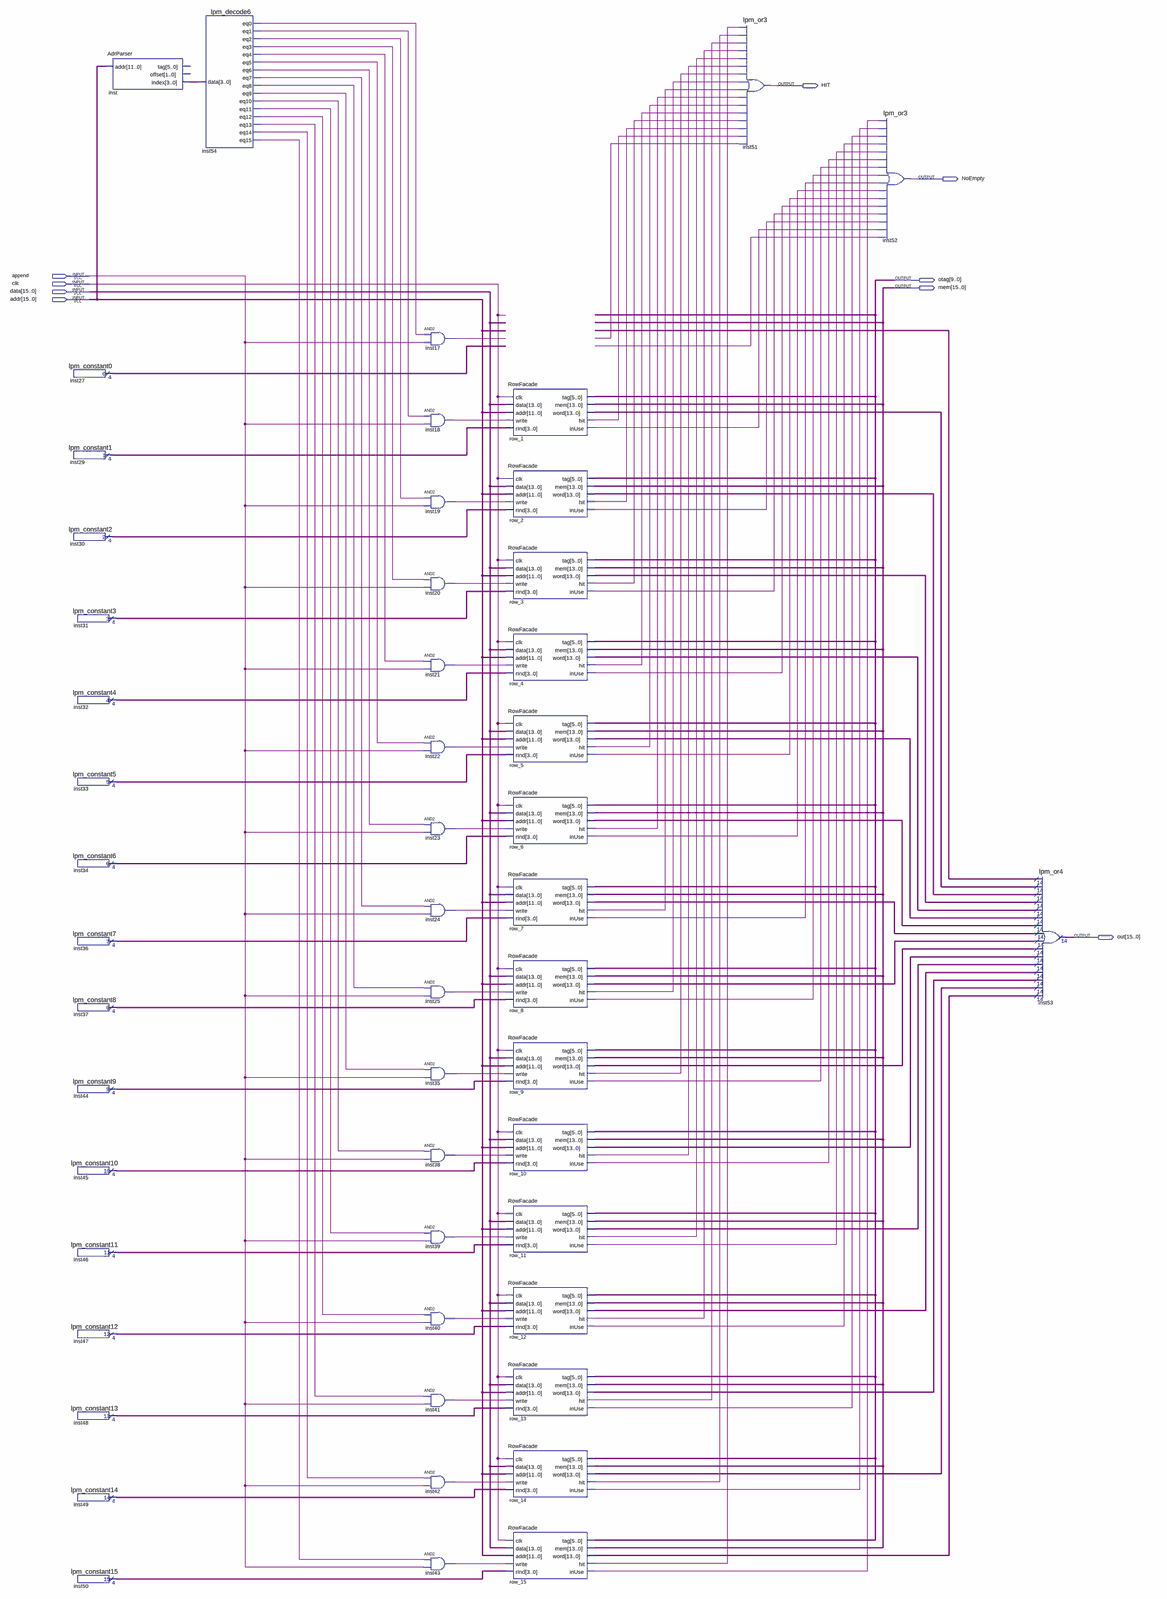
[diagram p0: schematic sheet, whole]
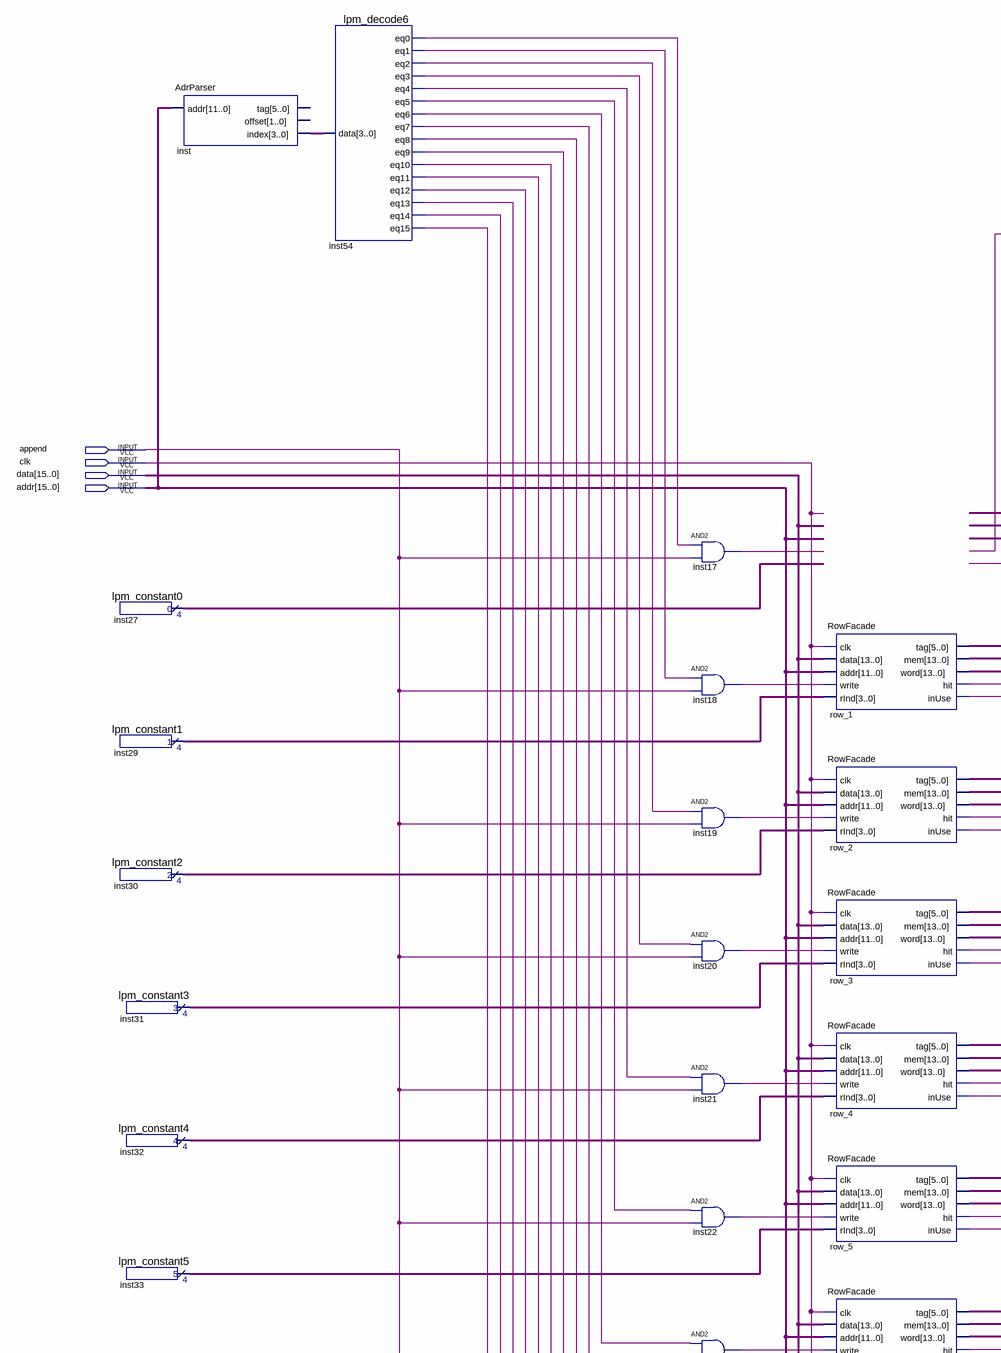
[diagram p1: schematic sheet, upper left part]
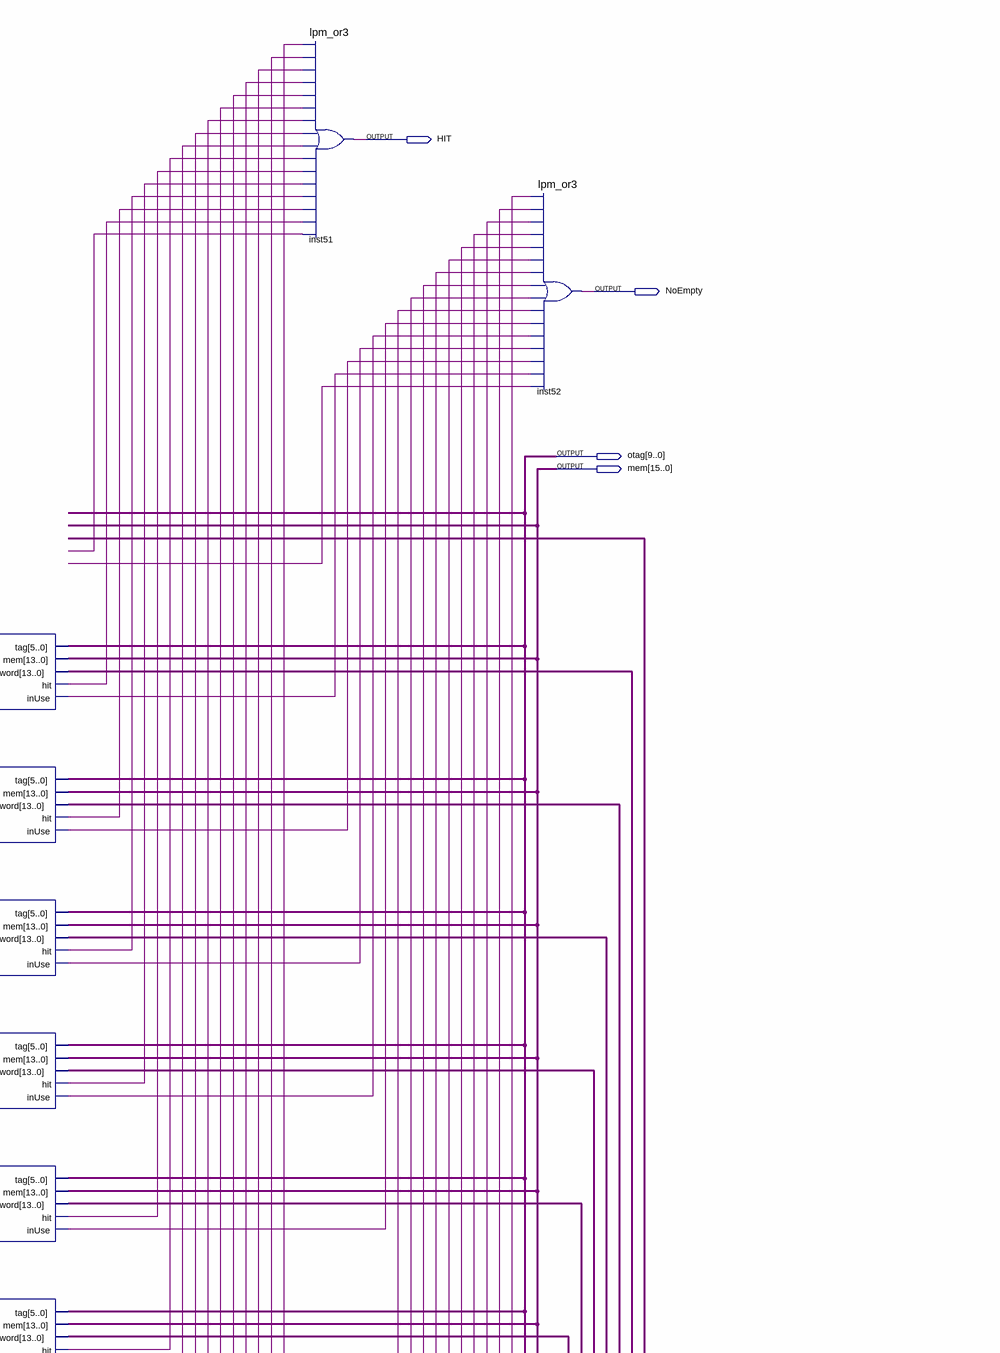
[diagram p2: schematic sheet, upper right part]
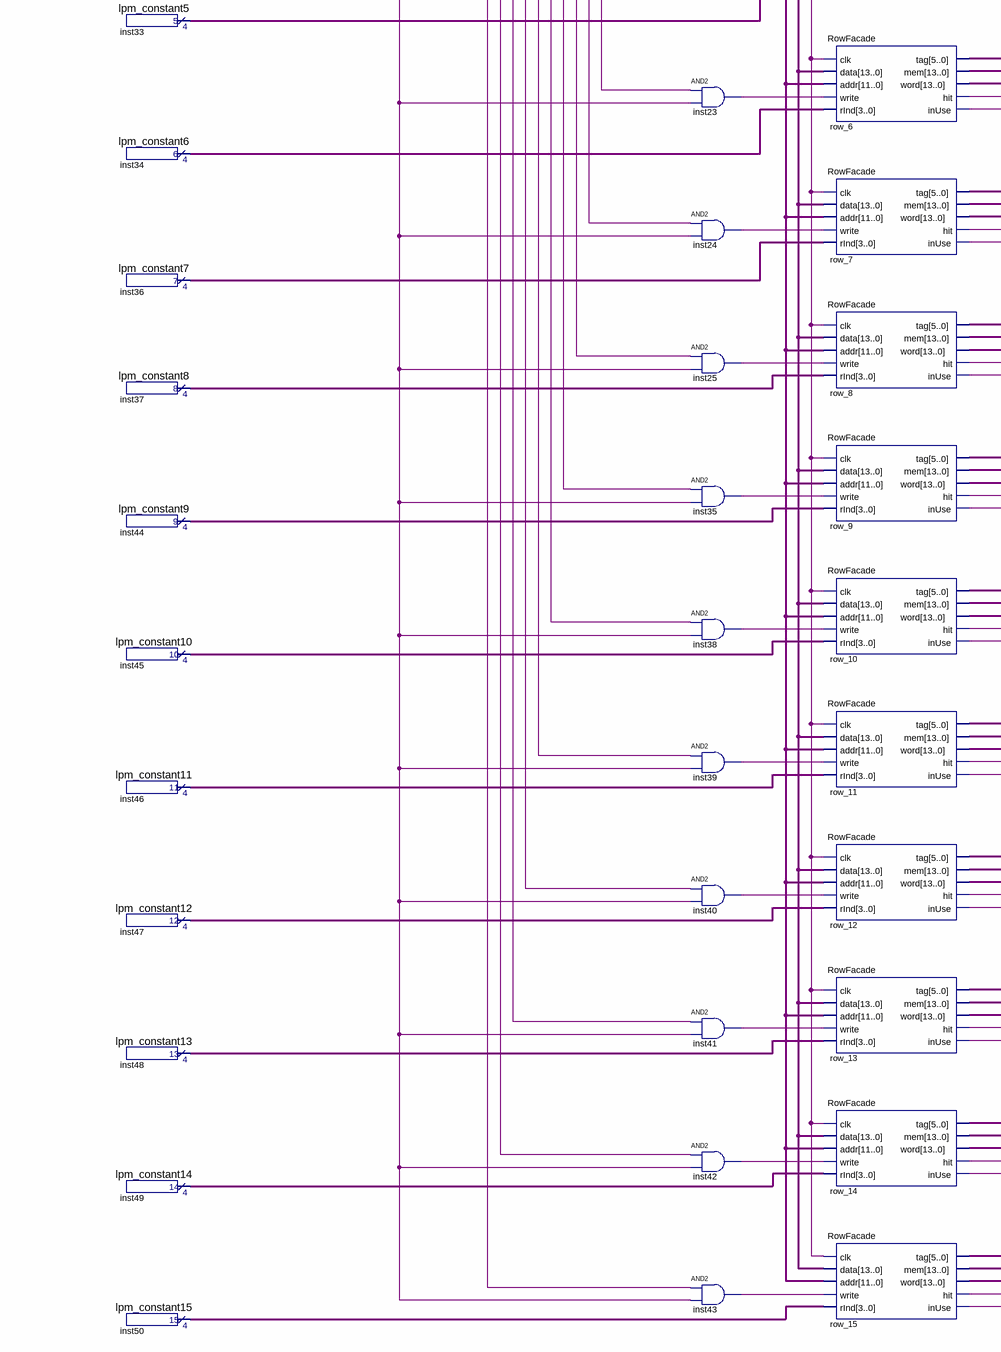
[diagram p3: schematic sheet, lower left part]
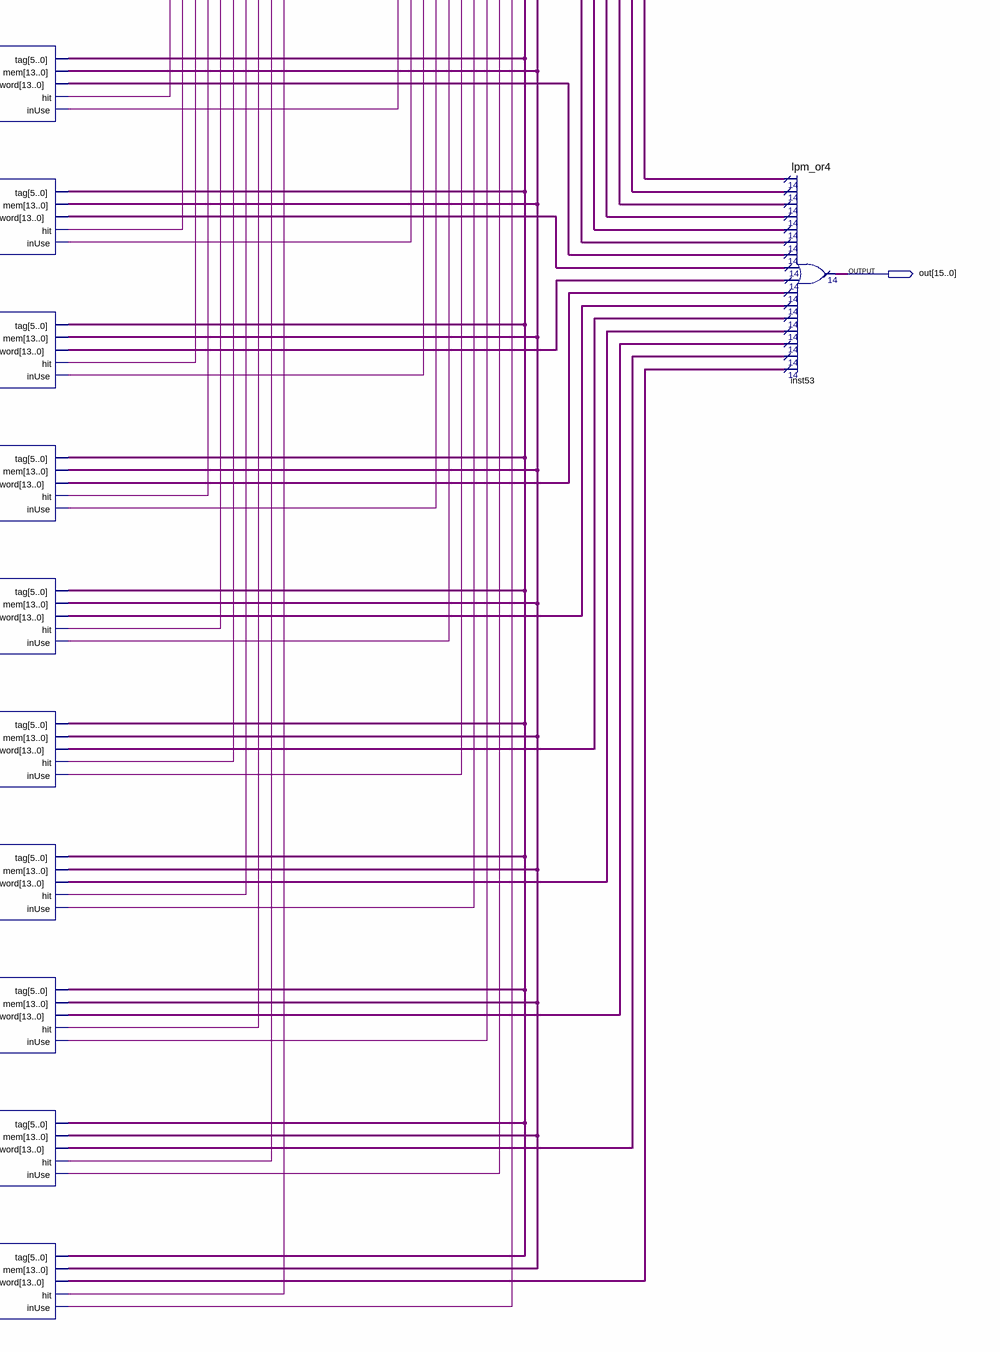
[diagram p4: schematic sheet, lower right part]
// Quartus schematic cache_bank.bdf as structural Verilog: 52 symbols, 9 pins
module cache_bank (
  input  append,
  input  clk,
  input  [15:0] data,
  input  [15:0] addr,
  output HIT,
  output NoEmpty,
  output [9:0] otag,
  output [15:0] mem,
  output [15:0] out
);

  wire inst17_out, inst18_out, inst19_out, inst20_out, inst21_out, inst22_out, inst23_out, inst24_out,
       inst25_out, inst35_out, inst38_out, inst39_out, inst40_out, inst41_out, inst42_out, inst43_out,
       inst54_eq0, inst54_eq1, inst54_eq2, inst54_eq3, inst54_eq4, inst54_eq5, inst54_eq6, inst54_eq7,
       inst54_eq8, inst54_eq9, inst54_eq10, inst54_eq11, inst54_eq12, inst54_eq13, inst54_eq14, inst54_eq15,
       row_1_hit, row_1_inuse, row_2_hit, row_2_inuse, row_3_hit, row_3_inuse, row_4_hit, row_4_inuse,
       row_5_hit, row_5_inuse, row_6_hit, row_6_inuse, row_7_hit, row_7_inuse, row_8_hit, row_8_inuse,
       row_9_hit, row_9_inuse, row_10_hit, row_10_inuse, row_11_hit, row_11_inuse, row_12_hit, row_12_inuse,
       row_13_hit, row_13_inuse, row_14_hit, row_14_inuse, row_15_hit, row_15_inuse, undriven, undriven_3;
  wire [3:0] inst27_result, inst29_result, inst30_result, inst31_result, inst32_result, inst33_result,
       inst34_result, inst36_result, inst37_result, inst44_result, inst45_result, inst46_result,
       inst47_result, inst48_result, inst49_result, inst50_result, inst_index;
  wire [13:0] row_1_word, row_2_word, row_3_word, row_4_word, row_5_word, row_6_word, row_7_word, row_8_word,
       row_9_word, row_10_word, row_11_word, row_12_word, row_13_word, row_14_word, row_15_word, undriven_2;

  lpm_constant0 inst27 (.result(inst27_result));
  lpm_constant1 inst29 (.result(inst29_result));
  lpm_constant2 inst30 (.result(inst30_result));
  lpm_constant3 inst31 (.result(inst31_result));
  lpm_constant4 inst32 (.result(inst32_result));
  lpm_constant5 inst33 (.result(inst33_result));
  lpm_constant6 inst34 (.result(inst34_result));
  lpm_constant7 inst36 (.result(inst36_result));
  lpm_constant8 inst37 (.result(inst37_result));
  lpm_constant9 inst44 (.result(inst44_result));
  lpm_constant10 inst45 (.result(inst45_result));
  lpm_constant11 inst46 (.result(inst46_result));
  lpm_constant12 inst47 (.result(inst47_result));
  lpm_constant13 inst48 (.result(inst48_result));
  lpm_constant14 inst49 (.result(inst49_result));
  lpm_constant15 inst50 (.result(inst50_result));
  AdrParser inst (.addr(addr), .index(inst_index));  // open: tag, offset
  lpm_decode6 inst54 (
    .data(inst_index), .eq0(inst54_eq0), .eq1(inst54_eq1), .eq2(inst54_eq2), .eq3(inst54_eq3),
    .eq4(inst54_eq4), .eq5(inst54_eq5), .eq6(inst54_eq6), .eq7(inst54_eq7), .eq8(inst54_eq8),
    .eq9(inst54_eq9), .eq10(inst54_eq10), .eq11(inst54_eq11), .eq12(inst54_eq12), .eq13(inst54_eq13),
    .eq14(inst54_eq14), .eq15(inst54_eq15));
  and inst17 (inst17_out, inst54_eq0, append);
  and inst18 (inst18_out, inst54_eq1, append);
  and inst19 (inst19_out, inst54_eq2, append);
  and inst20 (inst20_out, inst54_eq3, append);
  and inst21 (inst21_out, inst54_eq4, append);
  and inst22 (inst22_out, inst54_eq5, append);
  and inst23 (inst23_out, inst54_eq6, append);
  and inst24 (inst24_out, inst54_eq7, append);
  and inst25 (inst25_out, inst54_eq8, append);
  and inst35 (inst35_out, inst54_eq9, append);
  and inst38 (inst38_out, inst54_eq10, append);
  and inst39 (inst39_out, inst54_eq11, append);
  and inst40 (inst40_out, inst54_eq12, append);
  and inst41 (inst41_out, inst54_eq13, append);
  and inst42 (inst42_out, inst54_eq14, append);
  and inst43 (inst43_out, inst54_eq15, append);
  RowFacade row_1 (
    .clk(clk), .data(data), .addr(addr), .write(inst18_out), .rInd(inst29_result), .tag(otag), .mem(mem),
    .word(row_1_word), .hit(row_1_hit), .inUse(row_1_inuse));
  RowFacade row_2 (
    .clk(clk), .data(data), .addr(addr), .write(inst19_out), .rInd(inst30_result), .tag(otag), .mem(mem),
    .word(row_2_word), .hit(row_2_hit), .inUse(row_2_inuse));
  RowFacade row_3 (
    .clk(clk), .data(data), .addr(addr), .write(inst20_out), .rInd(inst31_result), .tag(otag), .mem(mem),
    .word(row_3_word), .hit(row_3_hit), .inUse(row_3_inuse));
  RowFacade row_4 (
    .clk(clk), .data(data), .addr(addr), .write(inst21_out), .rInd(inst32_result), .tag(otag), .mem(mem),
    .word(row_4_word), .hit(row_4_hit), .inUse(row_4_inuse));
  RowFacade row_5 (
    .clk(clk), .data(data), .addr(addr), .write(inst22_out), .rInd(inst33_result), .tag(otag), .mem(mem),
    .word(row_5_word), .hit(row_5_hit), .inUse(row_5_inuse));
  RowFacade row_6 (
    .clk(clk), .data(data), .addr(addr), .write(inst23_out), .rInd(inst34_result), .tag(otag), .mem(mem),
    .word(row_6_word), .hit(row_6_hit), .inUse(row_6_inuse));
  RowFacade row_7 (
    .clk(clk), .data(data), .addr(addr), .write(inst24_out), .rInd(inst36_result), .tag(otag), .mem(mem),
    .word(row_7_word), .hit(row_7_hit), .inUse(row_7_inuse));
  RowFacade row_8 (
    .clk(clk), .data(data), .addr(addr), .write(inst25_out), .rInd(inst37_result), .tag(otag), .mem(mem),
    .word(row_8_word), .hit(row_8_hit), .inUse(row_8_inuse));
  RowFacade row_9 (
    .clk(clk), .data(data), .addr(addr), .write(inst35_out), .rInd(inst44_result), .tag(otag), .mem(mem),
    .word(row_9_word), .hit(row_9_hit), .inUse(row_9_inuse));
  RowFacade row_10 (
    .clk(clk), .data(data), .addr(addr), .write(inst38_out), .rInd(inst45_result), .tag(otag), .mem(mem),
    .word(row_10_word), .hit(row_10_hit), .inUse(row_10_inuse));
  RowFacade row_11 (
    .clk(clk), .data(data), .addr(addr), .write(inst39_out), .rInd(inst46_result), .tag(otag), .mem(mem),
    .word(row_11_word), .hit(row_11_hit), .inUse(row_11_inuse));
  RowFacade row_12 (
    .clk(clk), .data(data), .addr(addr), .write(inst40_out), .rInd(inst47_result), .tag(otag), .mem(mem),
    .word(row_12_word), .hit(row_12_hit), .inUse(row_12_inuse));
  RowFacade row_13 (
    .clk(clk), .data(data), .addr(addr), .write(inst41_out), .rInd(inst48_result), .tag(otag), .mem(mem),
    .word(row_13_word), .hit(row_13_hit), .inUse(row_13_inuse));
  RowFacade row_14 (
    .clk(clk), .data(data), .addr(addr), .write(inst42_out), .rInd(inst49_result), .tag(otag), .mem(mem),
    .word(row_14_word), .hit(row_14_hit), .inUse(row_14_inuse));
  RowFacade row_15 (
    .clk(clk), .data(data), .addr(addr), .write(inst43_out), .rInd(inst50_result), .tag(otag), .mem(mem),
    .word(row_15_word), .hit(row_15_hit), .inUse(row_15_inuse));
  lpm_or3 inst51 (
    .data0(row_15_hit), .data1(row_14_hit), .data2(row_13_hit), .data3(row_12_hit), .data4(row_11_hit),
    .data5(row_10_hit), .data6(row_9_hit), .data7(row_8_hit), .data8(row_7_hit), .data9(row_6_hit),
    .data10(row_5_hit), .data11(row_4_hit), .data12(row_3_hit), .data13(row_2_hit), .data14(row_1_hit),
    .data15(undriven_3), .result(HIT));
  lpm_or3 inst52 (
    .data0(row_15_inuse), .data1(row_14_inuse), .data2(row_13_inuse), .data3(row_12_inuse),
    .data4(row_11_inuse), .data5(row_10_inuse), .data6(row_9_inuse), .data7(row_8_inuse),
    .data8(row_7_inuse), .data9(row_6_inuse), .data10(row_5_inuse), .data11(row_4_inuse),
    .data12(row_3_inuse), .data13(row_2_inuse), .data14(row_1_inuse), .data15(undriven), .result(NoEmpty));
  lpm_or4 inst53 (
    .data0x(undriven_2), .data1x(row_1_word), .data2x(row_2_word), .data3x(row_3_word), .data4x(row_4_word),
    .data5x(row_5_word), .data6x(row_6_word), .data7x(row_7_word), .data8x(row_8_word), .data9x(row_9_word),
    .data10x(row_10_word), .data11x(row_11_word), .data12x(row_12_word), .data13x(row_13_word),
    .data14x(row_14_word), .data15x(row_15_word), .result(out));
endmodule
